# Altium schematic sheet table_of_companents.SchDoc
size A; SheetNumber: 2; SheetTotal: 2
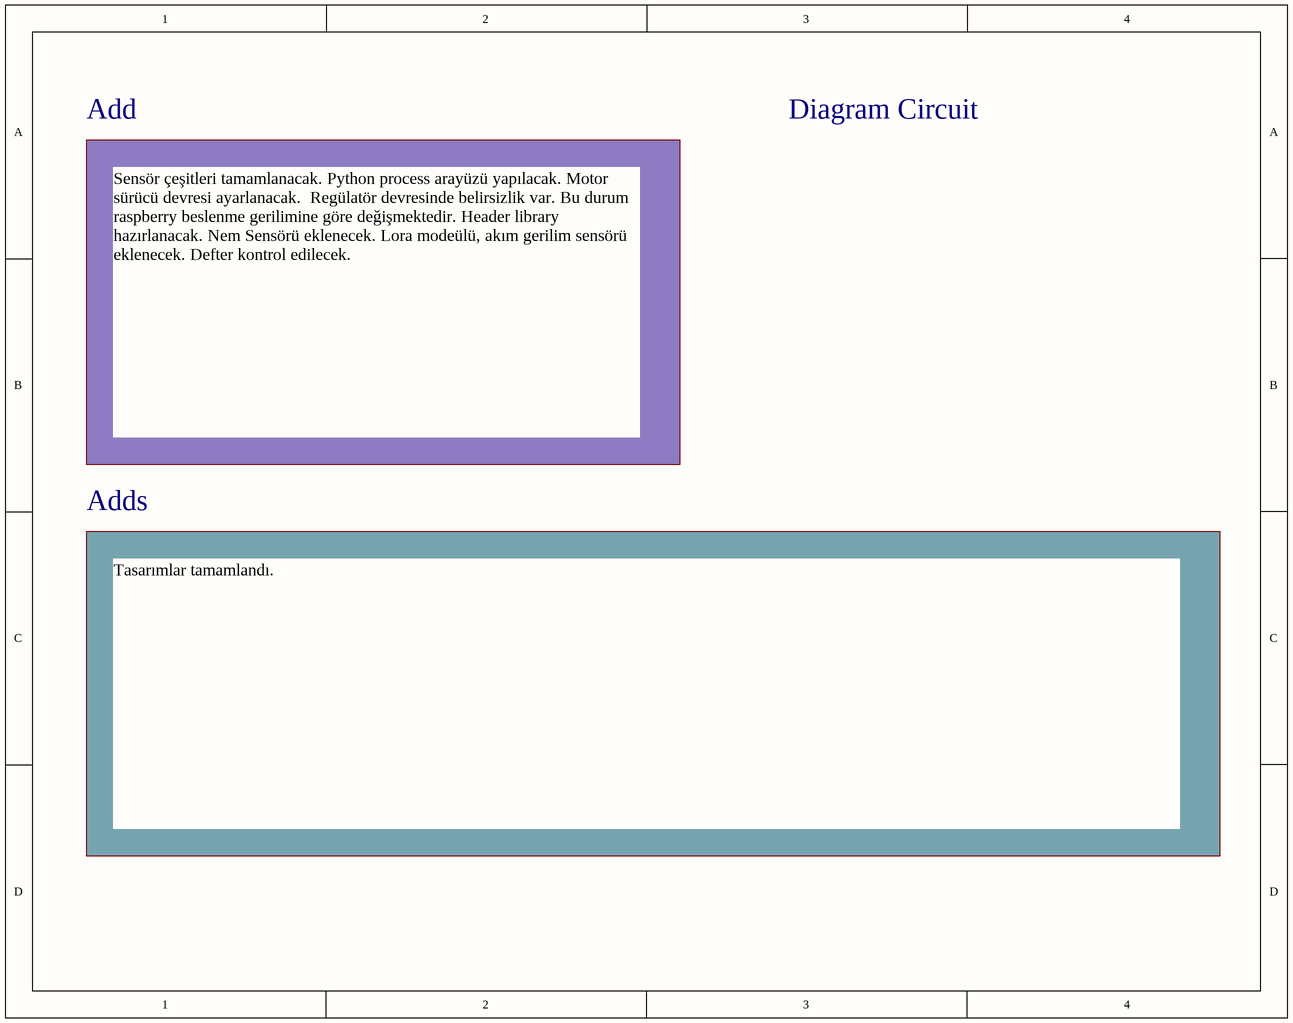
[diagram p0: table_of_companents.SchDoc]

## Notes on the sheet
- Add
- Diagram Circuit
- Sensör çeşitleri tamamlanacak. Python process arayüzü yapılacak. Motor sürücü devresi ayarlanacak.  Regülatör devresinde belirsizlik var. Bu durum raspberry beslenme gerilimine göre değişmektedir. Header library hazırlanacak. Nem Sensörü eklenecek. Lora modeülü, akım gerilim sensörü eklenecek. Defter kontrol edilecek.
- Adds
- Tasarımlar tamamlandı.